# EAGLE schematic Schematic v21 (EAGLE 9.7.0)
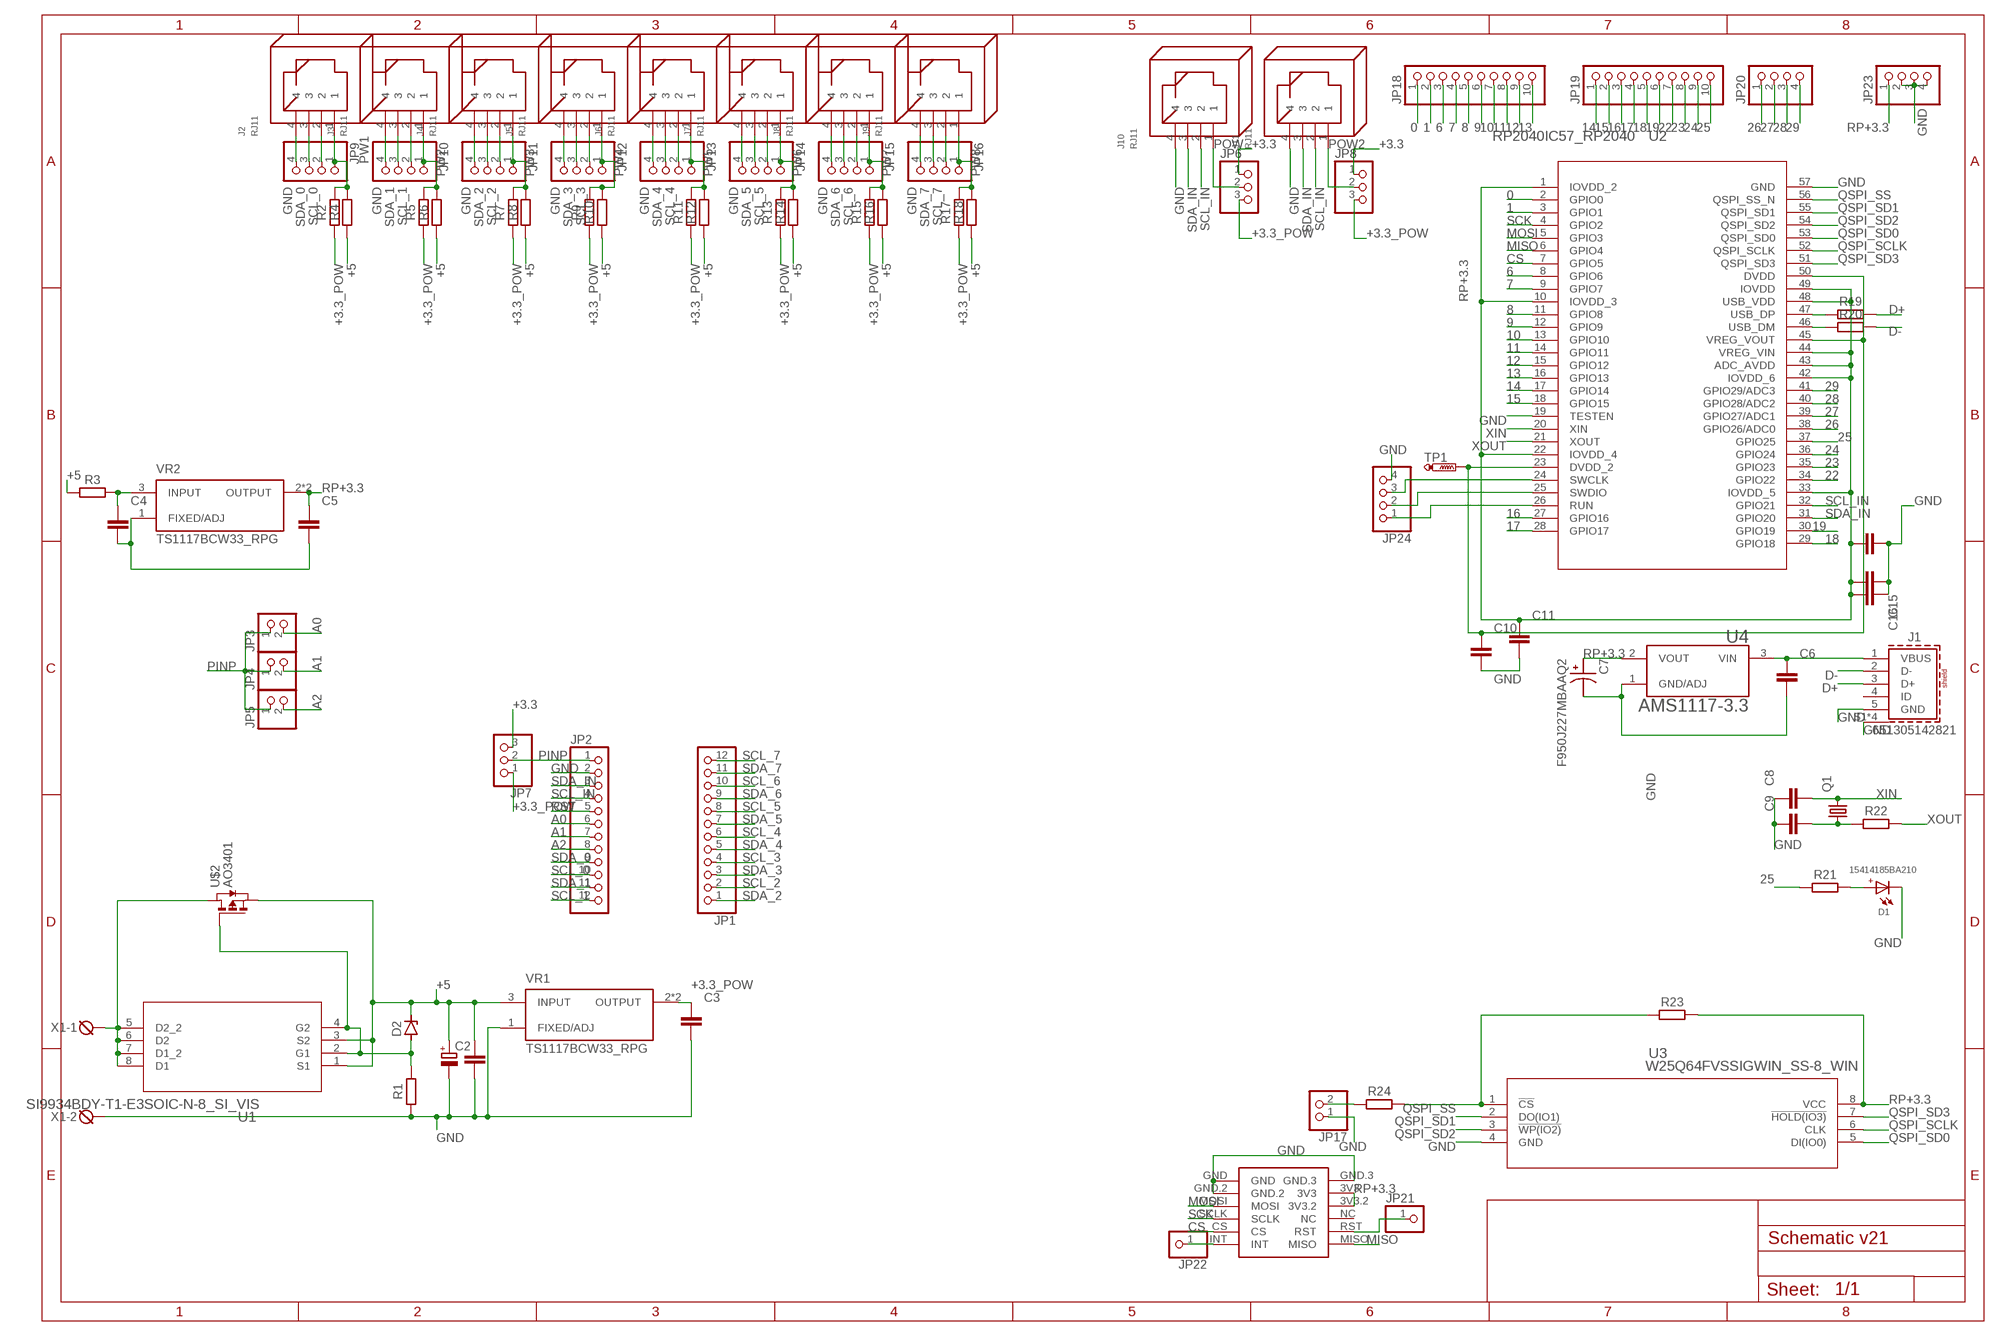
[diagram p0: schematic, sheet 1]

## Parts
C1  C_CHIP-0805(2012-METRIC)  [CAPC2012X110]
C2  C-POL_RADIAL-11MM-DIA  [CAPPRD508W65D1000H1100B]
C3  C_CHIP-0805(2012-METRIC)  [CAPC2012X110]
C4  C_CHIP-0805(2012-METRIC)  [CAPC2012X110]
C5  C_CHIP-0805(2012-METRIC)  [CAPC2012X110]
C6  C_CHIP-0805(2012-METRIC)  [CAPC2012X110]
C7  F950J227MBAAQ2  [CAPCP3528X200N]
C8  C_CHIP-0805(2012-METRIC)  [CAPC2012X110]
C9  C_CHIP-0805(2012-METRIC)  [CAPC2012X110]
C10  C_CHIP-0805(2012-METRIC)  [CAPC2012X110]
C11  C_CHIP-0805(2012-METRIC)  [CAPC2012X110]
C12  C_CHIP-0805(2012-METRIC)  [CAPC2012X110]
C15  C_CHIP-0805(2012-METRIC)  [CAPC2012X110]
C16  C_CHIP-0805(2012-METRIC)  [CAPC2012X110]
D1  15414185BA210  WL-SITW_3528_15414185BA210  [WL-SITW_3528]
D2  ZENER-DIODESOD80C  [SOD80C]
J1  651305142821  [651305142821]
J2  RJ11  [RJ11]
J3  RJ11  [RJ11]
J4  RJ11  [RJ11]
J5  RJ11  [RJ11]
J6  RJ11  [RJ11]
J7  RJ11  [RJ11]
J8  RJ11  [RJ11]
J9  RJ11  [RJ11]
J10  RJ11  [RJ11]
J11  RJ11  [RJ11]
JP1  PINHD-1X12  [1X12]
JP2  PINHD-1X12  [1X12]
JP3  PINHD-1X2  [1X02]
JP4  PINHD-1X2  [1X02]
JP5  PINHD-1X2  [1X02]
JP6  PINHD-1X3  [1X03]
JP7  PINHD-1X3  [1X03]
JP8  PINHD-1X3  [1X03]
JP9  PINHD-1X4  [1X04]
JP10  PINHD-1X4  [1X04]
JP11  PINHD-1X4  [1X04]
JP12  PINHD-1X4  [1X04]
JP13  PINHD-1X4  [1X04]
JP14  PINHD-1X4  [1X04]
JP15  PINHD-1X4  [1X04]
JP16  PINHD-1X4  [1X04]
JP17  PINHD-1X2  [1X02]
JP18  PINHD-1X10  [1X10]
JP19  PINHD-1X10  [1X10]
JP20  PINHD-1X4  [1X04]
JP21  PINHD-1X1  [1X01]
JP22  PINHD-1X1  [1X01]
JP23  PINHD-1X4  [1X04]
JP24  PINHD-1X4  [1X04]
Q1  KX-9A  [5.0X3.2_KX-9A]
R1  R_AXIAL-7.2MM-PITCH  [RESAD724W46L381D178B]
R2  R_CHIP-0805(2012-METRIC)  [RESC2012X65]
R3  R_CHIP-1206(3216-METRIC)  [RESC3216X70]
R4  R_CHIP-0805(2012-METRIC)  [RESC2012X65]
R5  R_CHIP-0805(2012-METRIC)  [RESC2012X65]
R6  R_CHIP-0805(2012-METRIC)  [RESC2012X65]
R7  R_CHIP-0805(2012-METRIC)  [RESC2012X65]
R8  R_CHIP-0805(2012-METRIC)  [RESC2012X65]
R9  R_CHIP-0805(2012-METRIC)  [RESC2012X65]
R10  R_CHIP-0805(2012-METRIC)  [RESC2012X65]
R11  R_CHIP-0805(2012-METRIC)  [RESC2012X65]
R12  R_CHIP-0805(2012-METRIC)  [RESC2012X65]
R13  R_CHIP-0805(2012-METRIC)  [RESC2012X65]
R14  R_CHIP-0805(2012-METRIC)  [RESC2012X65]
R15  R_CHIP-0805(2012-METRIC)  [RESC2012X65]
R16  R_CHIP-0805(2012-METRIC)  [RESC2012X65]
R17  R_CHIP-0805(2012-METRIC)  [RESC2012X65]
R18  R_CHIP-0805(2012-METRIC)  [RESC2012X65]
R19  R_CHIP-0805(2012-METRIC)  [RESC2012X65]
R20  R_CHIP-0805(2012-METRIC)  [RESC2012X65]
R21  R_CHIP-1206(3216-METRIC)  [RESC3216X70]
R22  R_CHIP-1206(3216-METRIC)  [RESC3216X70]
R23  R_CHIP-1206(3216-METRIC)  [RESC3216X70]
R24  R_CHIP-1206(3216-METRIC)  [RESC3216X70]
TP1  PTR1B1,27  [B1,27]
U1  SI9934BDY-T1-E3SOIC-N-8_SI_VIS  [SOIC-N-8_SI_VIS]
U2  RP2040IC57_RP2040  [IC57_RP2040]
U3  W25Q64FVSSIGWIN_SS-8_WIN  [WIN_SS-8_WIN]
U4  AMS1117-3.3  [SOT229P700X180-4N]
U$1  MINI_W5500  [MINI_W5500]
U$2  AO3401  [SOT23]
VR1  TS1117BCW33_RPG  [VREG_TS1117BCW33_RPG]
VR2  TS1117BCW33_RPG  [VREG_TS1117BCW33_RPG]
X1  DG3XX-02-3.5  [DG350-3.5-02P]

## Nets
0 [pins]: JP18.1 U2.2(GPIO0)
1 [pins]: JP18.2 U2.3(GPIO1)
6 [pins]: JP18.3 U2.8(GPIO6)
7 [pins]: JP18.4 U2.9(GPIO7)
8 [pins]: JP18.5 U2.11(GPIO8)
9 [pins]: JP18.6 U2.12(GPIO9)
10 [pins]: JP18.7 U2.13(GPIO10)
11 [pins]: JP18.8 U2.14(GPIO11)
12 [pins]: JP18.9 U2.15(GPIO12)
13 [pins]: JP18.10 U2.16(GPIO13)
14 [pins]: JP19.1 U2.17(GPIO14)
15 [pins]: JP19.2 U2.18(GPIO15)
16 [pins]: JP19.3 U2.27(GPIO16)
17 [pins]: JP19.4 U2.28(GPIO17)
18 [pins]: JP19.5 U2.29(GPIO18)
19 [pins]: JP19.6 U2.30(GPIO19)
22 [pins]: JP19.7 U2.34(GPIO22)
23 [pins]: JP19.8 U2.35(GPIO23)
24 [pins]: JP19.9 U2.36(GPIO24)
25 [pins]: JP19.10 R21.1 U2.37(GPIO25)
26 [pins]: JP20.1 U2.38(GPIO26/ADC0)
27 [pins]: JP20.2 U2.39(GPIO27/ADC1)
28 [pins]: JP20.3 U2.40(GPIO28/ADC2)
29 [pins]: JP20.4 U2.41(GPIO29/ADC3)
+3.3 [power]: JP6.1 JP7.3 JP8.1
+3.3_POW [power]: C3.1 JP6.3 JP7.1 JP8.3 R2.1 R5.1 R7.1 R9.1 R11.1 R13.1 R15.1 R17.1 VR1.2(OUTPUT) VR1.4(OUTPUT)
+5 [power]: C1.1 C2.1(+) D2.C R3.1 R4.1 R6.1 R8.1 R10.1 R12.1 R14.1 R16.1 R18.1 U1.1(S1) U1.3(S2) U$2.2(S) VR1.3(INPUT)
A0 [data]: JP2.6 JP3.2
A1 [data]: JP2.7 JP4.2
A2 [data]: JP2.8 JP5.2
CS: U2.7(GPIO5) U$1.CS
D+ [data]: J1.3(D+) R19.2
D- [data]: J1.2(D-) R20.2
GND: C1.2 C2.2(-) C3.2 C6.2 C7.2 C8.1 C9.1 C10.2 C11.2 C12.1 C15.1 C16.1 D1.2(-) J1.5(GND) J1.S1(SHIELD) J1.S2(SHIELD) J1.S3(SHIELD) J1.S4(SHIELD) J2.4 J3.4 J4.4 J5.4 J6.4 J7.4 J8.4 J9.4 J10.4 J11.4 JP2.2 JP9.4 JP10.4 JP11.4 JP12.4 JP13.4 JP14.4 JP15.4 JP16.4 JP17.1 JP23.2 JP23.3 JP23.4 JP24.4 R1.1 U2.19(TESTEN) U2.57(GND) U3.4(GND) U4.1(GND/ADJ) U$1.GND U$1.GND.2 U$1.GND.3 VR1.1(FIXED/ADJ) X1.2
MISO: U2.6(GPIO4) U$1.MISO
MOSI: U2.5(GPIO3) U$1.MOSI
N$1: R19.1 U2.47(USB_DP)
N$2: C4.2 C5.2 VR2.1(FIXED/ADJ)
N$3: D2.A R1.2 U1.2(G1) U1.4(G2) U$2.1(G)
N$4: U1.5(D2_2) U1.6(D2) U1.7(D1_2) U1.8(D1) U$2.3(D) X1.1
N$5: JP24.1 U2.26(RUN)
N$6: C4.1 R3.2 VR2.3(INPUT)
N$7: JP24.2 U2.25(SWDIO)
N$8: JP22.1 U$1.INT
N$9: JP21.1 U$1.RST
N$10: JP24.3 U2.24(SWCLK)
N$33: D1.1(+) R21.2
N$38: R20.1 U2.46(USB_DM)
N$40: C6.1 J1.1(VBUS) U4.3(VIN)
N$43: C9.2 Q1.1 R22.1
N$44: C10.1 TP1.TP U2.23(DVDD_2) U2.45(VREG_VOUT) U2.50(DVDD)
N$47: JP17.2 R24.1
PINP [power]: JP2.1 JP3.1 JP4.1 JP5.1 JP7.2
POW [power]: J10.1 JP6.2
POW2 [power]: J11.1 JP8.2
PW1 [power]: J2.1 JP9.1 R2.2 R4.2
PW2 [power]: J3.1 JP10.1 R5.2 R6.2
PW3 [power]: J4.1 JP11.1 R7.2 R8.2
PW4 [power]: J5.1 JP12.1 R9.2 R10.2
PW5 [power]: J6.1 JP13.1 R11.2 R12.2
PW6 [power]: J7.1 JP14.1 R13.2 R14.2
PW7 [power]: J8.1 JP15.1 R15.2 R16.2
PW8 [power]: J9.1 JP16.1 R17.2 R18.2
QSPI_SCLK: U2.52(QSPI_SCLK) U3.6(CLK)
QSPI_SD0: U2.53(QSPI_SD0) U3.5(DI(IO0))
QSPI_SD1: U2.55(QSPI_SD1) U3.2(DO(IO1))
QSPI_SD2: U2.54(QSPI_SD2) U3.3(!WP(IO2))
QSPI_SD3: U2.51(QSPI_SD3) U3.7(!HOLD(IO3))
QSPI_SS: R23.1 R24.2 U2.56(QSPI_SS_N) U3.1(!CS)
RP+3.3 [rpipow]: C5.1 C7.1 C11.1 C12.2 C15.2 C16.2 JP23.1 R23.2 U2.1(IOVDD_2) U2.10(IOVDD_3) U2.22(IOVDD_4) U2.33(IOVDD_5) U2.42(IOVDD_6) U2.43(ADC_AVDD) U2.44(VREG_VIN) U2.48(USB_VDD) U2.49(IOVDD) U3.8(VCC) U4.2(VOUT) U$1.3V3 U$1.3V3.2 VR2.2(OUTPUT) VR2.4(OUTPUT)
RST [data]: JP2.5
SCK: U2.4(GPIO2) U$1.SCLK
SCL_0 [data]: J2.2 JP2.10 JP9.2
SCL_1 [data]: J3.2 JP2.12 JP10.2
SCL_2 [data]: J4.2 JP1.2 JP11.2
SCL_3 [data]: J5.2 JP1.4 JP12.2
SCL_4 [data]: J6.2 JP1.6 JP13.2
SCL_5 [data]: J7.2 JP1.8 JP14.2
SCL_6 [data]: J8.2 JP1.10 JP15.2
SCL_7 [data]: J9.2 JP1.12 JP16.2
SCL_IN: J10.2 J11.2 JP2.4 U2.32(GPIO21)
SDA_0 [data]: J2.3 JP2.9 JP9.3
SDA_1 [data]: J3.3 JP2.11 JP10.3
SDA_2 [data]: J4.3 JP1.1 JP11.3
SDA_3 [data]: J5.3 JP1.3 JP12.3
SDA_4 [data]: J6.3 JP1.5 JP13.3
SDA_5 [data]: J7.3 JP1.7 JP14.3
SDA_6 [data]: J8.3 JP1.9 JP15.3
SDA_7 [data]: J9.3 JP1.11 JP16.3
SDA_IN: J10.3 J11.3 JP2.3 U2.31(GPIO20)
XIN: C8.2 Q1.3 U2.20(XIN)
XOUT: R22.2 U2.21(XOUT)
Unconnected: J1.4(ID) U$1.NC

## Library data of the parts
C1 C3-C6 C8-C12 C15 C16 = Capacitor:C: Capacitor - Generic; CATEGORY: Capacitor
C2 = Capacitor:C-POL: Capacitor Polarised - Generic; CATEGORY: Capacitor
C7 = F950J227MBAAQ2:F950J227MBAAQ2: Check availability <https://pricing.snapeda.com/parts/F950J227MBAAQ2/KYOCERA%20AVX/view-part?ref=eda>; AVAILABILITY: In Stock; CHECK_PRICES: https://www.snapeda.com/parts/F950J227MBAAQ2/Kyocera/view-part/?ref=eda; DESCRIPTION: Cap Tant Solid 220uF 6.3V B CASE 20% (3.5 X 2.8 X 1.8mm) Pad SMD 3528-20 0.4 Ohm 125°C T/R; MF: KYOCERA AVX; MP: F950J227MBAAQ2; PACKAGE: 3528 AVX; PRICE: None; SNAPEDA_LINK: https://www.snapeda.com/parts/F950J227MBAAQ2/Kyocera/view-part/?ref=snap
D1 = Wurth_Infrared_WL-SITW:WL-SITW_3528: WL-SITW SMT Infrared TOP LED Waterclear Characteristics Standard size 3528 Low energy consumption High reliability Low current requirement Fast switching IR Emitter Applications Infrared sensor Distance measure Remote control IR Lightbarrier Smoke detector <https://www.we-online.com/catalog/media/o121487v209%20Family_SITW-3528_15414185BA220.jpg> Details see: https://www.we-online.com/catalog/en/WL-SITW/ Updated By Yingchun Shan 2020-03-24 2020 (C) Wurth Elektronik; CENTROID-WAVELENGTH: 845nm; CENTROID-WAVELENGTH-MIN: 5mW/sr; CENTROID-WAVELENGTH-TYP: 9mW/sr; CHIP-TECHNOLOGY: AlGaAs; DATASHEET-URL: https://www.we-online.com/catalog/datasheet/15414185BA210.pdf; EMITTING-COLOR: Infrared; FORWARD-VOLTAGE-MAX: 2V; FORWARD-VOLTAGE-TYP: 1.5V; HEIGHT: 1.9mm; PART-NUMBER: 15414185BA210; PEAK-WAVELENGTH: 850nm; VIEWING-ANGLE: 120°
D2 = diode:ZENER-DIODE: Z-Diode
J1 = Wurth_Connectors_WR-USB:651305142821: WR-COM Mini USB 2.0 Type AB SMT Horizontal 5 Contacts Kind Properties Durability:1 500 Mating cycles Connector Type:Mini USB Gender:Receptacle Type:Horizontal General Information Operating Temperature:-40up to +105 °C Electrical Properties Working Voltage:30V (AC) Withstanding Voltage:750V (AC) Contact Resistance:20 mΩ Material Properties Insulator Material:LCP Insulator Flammability Rating:UL94 V-0 Color:Black Cover Material:Brass Cover Plating:Tin Contact Material:Copper Alloy Contact Plating: Selective Gold Contact Type:Stamped Shielding Material:Brass Shielding Plating:Nickel <https://www.we-online.com/catalog/media/o32880v209%20Family_WR-651305142821.jpg> Details see: https://www.we-online.com/catalog/en/COM_SMT_MINI_TYPE_AB_HORIZONTAL/ Updated by Yingchun, Shan 2020-01-16 2020 (C) Würth Elektronik; APPLICATION: Mini USB; DATASHEET-URL: https://www.we-online.com/redexpert/spec/651305142821?ae; GERDER: Receptacle; INTERFACE-TYPE: TypeAB; IR: 1A; MOUNT: SMT; PACKAGING: Tape and Reel; PART-NUMBER: 651305142821; PINS: 5; TYPE: Horizontal; WORKING-VOLTAGE: 30V(AC)
J2-J11 = con-rj:RJ11: RJ11, RJ22 RJ11 and RJ22 jacks side mounted http://www.tycoelectronics.com
JP1 JP2 = pinhead:PINHD-1X12: PIN HEADER
JP3-JP5 JP17 = pinhead:PINHD-1X2: PIN HEADER
JP6-JP8 = pinhead:PINHD-1X3: PIN HEADER
JP9-JP16 JP20 JP23 JP24 = pinhead:PINHD-1X4: PIN HEADER
JP18 JP19 = pinhead:PINHD-1X10: PIN HEADER
JP21 JP22 = pinhead:PINHD-1X1: PIN HEADER
Q1 = crystal-geyer_V1_0:KX: Quartz Crystals (MHz) SMD: KX - Serie Model Size l/w/h [mm] Frequency Range Frequency Stability Temp. Range [°C] Load Capacitance AECQ 200 availabel Datasheet KX-4 KX-5 KX-6 KX-7 KX-9A KX-9B KX-12A KX-12B KX-13 KX-20 KX-K KX-KS 1.6/1.2/0.3 2.0/1.6/0.45 2.5/2.0/0.55 3.2/2.5/0.8 5.0/3.2/1.0 5.0/3.2/1.1 6.0/3.5/1.1 6.0/3.5/1.0 7.0/5.0 /1.3 11.6/5.5/1.6 12.3/4.5/4.2 12.3/4.5/3.2 24.0 ~ 80.0 MHz 16.0 ~ 80.0 MHz 12.0 ~ 80.0 MHz 8.0 ~ 60.0 MHz 7,68 ~ 300,0 MHz 8,0 ~ 50,0 MHz 8,0 ~ 150,0 MHz 8,0 ~ 50,0 MHz 6,0 ~ 160,0 MHz 3,579 ~ 25,0 MHz 3,579 ~ 70,0 MHz 3,579 ~ 70,0 MHz ±10 … ±50ppm ±10 … ±50ppm ±10 … ±50ppm ±10 … ±50ppm ±10 … ±50ppm ±10 … ±50ppm ±10 … ±50ppm ±10 … ±50ppm ±10 … ±50ppm ±50ppm ±10 … ±50ppm ±10 … ±50ppm (*) -40°C …+85°C (*) -40°C …+125°C (*) -40°C …+125°C (*) -40°C …+125°C (*) -40°C …+105°C (*) -40°C …+105°C (*) -40°C …+125°C (*) -40°C …+105°C (*) -40°C …+105°C (*) -40°C …+105°C (*) -40°C …+85°C (*) -40°C …+85°C 8, 8…16 8, 8…16 10, 8…16 12, 7…20 16, 10…20 16, 10…20 16, 10…20 16, 12…20 16, 12…20 16, 12…20 16, 12…30 16, 12…30 - yes yes yes - - - - - - - - KX-4.pdf <http://www.geyer-electronic.de/uploads/tx_userartikelfrequenz/GEYER-KX-4.pdf> KX-5.pdf <http://www.geyer-electronic.de/uploads/tx_userartikelfrequenz/GEYER-KX-5.pdf> KX-6.pdf <http://www.geyer-electronic.de/uploads/tx_userartikelfrequenz/GEYER-KX-6.pdf> KX-7.pdf <http://www.geyer-electronic.de/uploads/tx_userartikelfrequenz/GEYER-KX-7.pdf> KX-9A.pdf <http://www.geyer-electronic.de/uploads/tx_userartikelfrequenz/GEYER-KX-9A.pdf> KX-9B.pdf <http://www.geyer-electronic.de/uploads/tx_userartikelfrequenz/GEYER-KX-9B.pdf> KX-12A.pdf <http://www.geyer-electronic.de/uploads/tx_userartikelfrequenz/GEYER-KX-12A.pdf> KX-12B.pdf <http://www.geyer-electronic.de/uploads/tx_userartikelfrequenz/GEYER-KX-12B.pdf> KX-13.pdf <http://www.geyer-electronic.de/uploads/tx_userartikelfrequenz/GEYER-KX-13.pdf> KX-20.pdf <http://www.geyer-electronic.de/uploads/tx_userartikelfrequenz/GEYER-KX-20.pdf> KX-K.pdf <http://www.geyer-electronic.de/uploads/tx_userartikelfrequenz/GEYER-KX-K.pdf> KX-KS.pdf <http://www.geyer-electronic.de/uploads/tx_userartikelfrequenz/GEYER-KX-KS.pdf> <http://www.geyer-electronic.de/fileadmin/template/img/logo-geyer-electronic.png> Details see: http://www.geyer-electronic.de/Frequenz-Produkte.9.0.html Created 2016-06-07, Hans Locher 2016 (C) Geyer Quartz Technology KX4,KX5,KX6,KX7,KX9A,KX9B,KX12A,KX12B,KX13,KX20,KXK,KXKS;1612;2016;2520;3225;5032;6035;7050;11655;12345;1,6x1,2;2,0x1,6;2,5x2,0;3,2x2,5;5,0x3,2;6,0x3,5;7,0x5,0;11,6x5,5;12,3x4,5;12,3x4,5;1.6x1.2;2.0x1.6;2.5x2.0;3.2x2.5;5.0x3.2;6.0x3.5;7.0x5.0;11.6x5.5;12.3x4.5;12.3x4.5;
R1-R24 = Resistor:R: Resistor Fixed - Generic; CATEGORY: Resistor; SUB-CATEGORY: Fixed
TP1 = testpad:PTR1: TEST PIN
U1 = 2025-02-21_07-23-54_Library:SI9934BDY-T1-E3; COPYRIGHT: Copyright (C) 2025 Ultra Librarian. All rights reserved.; MANUFACTURER_PART_NUMBER: SI9934BDY-T1-E3; MFR_NAME: Vishay
U2 = 2025-02-21_20-02-25_Library:RP2040; COPYRIGHT: Copyright (C) 2025 Ultra Librarian. All rights reserved.; MANUFACTURER_PART_NUMBER: RP2040; MFR_NAME: Raspberry Pi
U3 = 2025-02-22_13-02-44_Library:W25Q64FVSSIG; COPYRIGHT: Copyright (C) 2025 Ultra Librarian. All rights reserved.; MANUFACTURER_PART_NUMBER: W25Q64FVSSIG; MFR_NAME: Winbond
U4 = AMS1117-3.3:AMS1117-3.3: Check availability <https://pricing.snapeda.com/parts/AMS1117-3.3/ams%20AG/view-part?ref=eda>; AVAILABILITY: Not in stock; CHECK_PRICES: https://www.snapeda.com/parts/AMS1117-3.3/ams/view-part/?ref=eda; DESCRIPTION: LDO Voltage Regulators 800MA LDO LINEAR REG; MF: ams AG; MP: AMS1117-3.3; PACKAGE: SOT-223 Seeed Technology; PRICE: None; SNAPEDA_LINK: https://www.snapeda.com/parts/AMS1117-3.3/ams/view-part/?ref=snap
U$1 = ethernet-mikroavr:MINI_W5500: MINI ETHERNET W5500, CREATE BY MIKROAVR.COM
U$2 = AO3401:AO3401: Check availability <https://pricing.snapeda.com/parts/AO3401/Alpha%20%26%20Omega%20Semiconductor/view-part?ref=eda>; AVAILABILITY: In Stock; CHECK_PRICES: https://www.snapeda.com/parts/AO3401/Alpha/view-part/?ref=eda; DESCRIPTION: P-Channel 30 V 4A (Ta) 1.4W (Ta) Surface Mount SOT-23-3; MF: Alpha & Omega Semiconductor; MP: AO3401; PACKAGE: SOT-23-3 Alpha &amp; Omega Semiconductor; PRICE: None; SNAPEDA_LINK: https://www.snapeda.com/parts/AO3401/Alpha/view-part/?ref=snap
VR1 VR2 = TS1117BCW33_RPG:TS1117BCW33_RPG: Check availability <https://pricing.snapeda.com/parts/TS1117BCW33%20RPG/Taiwan%20Semiconductor/view-part?ref=eda>; AVAILABILITY: In Stock; CHECK_PRICES: https://www.snapeda.com/parts/TS1117BCW33%20RPG/taiwan/view-part/?ref=eda; DESCRIPTION: 1A 3.3V LOW DROPOUT VOLTAGE REGULATOR; MF: Taiwan Semiconductor; MP: TS1117BCW33 RPG; PACKAGE: SOT-223 Taiwan Semiconductor; PRICE: None; SNAPEDA_LINK: https://www.snapeda.com/parts/TS1117BCW33%20RPG/taiwan/view-part/?ref=snap
X1 = degson:DG3XX-02: DG350-3.5-02P DG306-5.0-02P

## Net classes
0 default: width 0.152 mm
1 power: width 0.635 mm
2 rpipow: width 0.152 mm
3 data: width 0.305 mm
4 pins: width 0.152 mm